# EAGLE schematic Dachmodul (EAGLE 8.2.0)
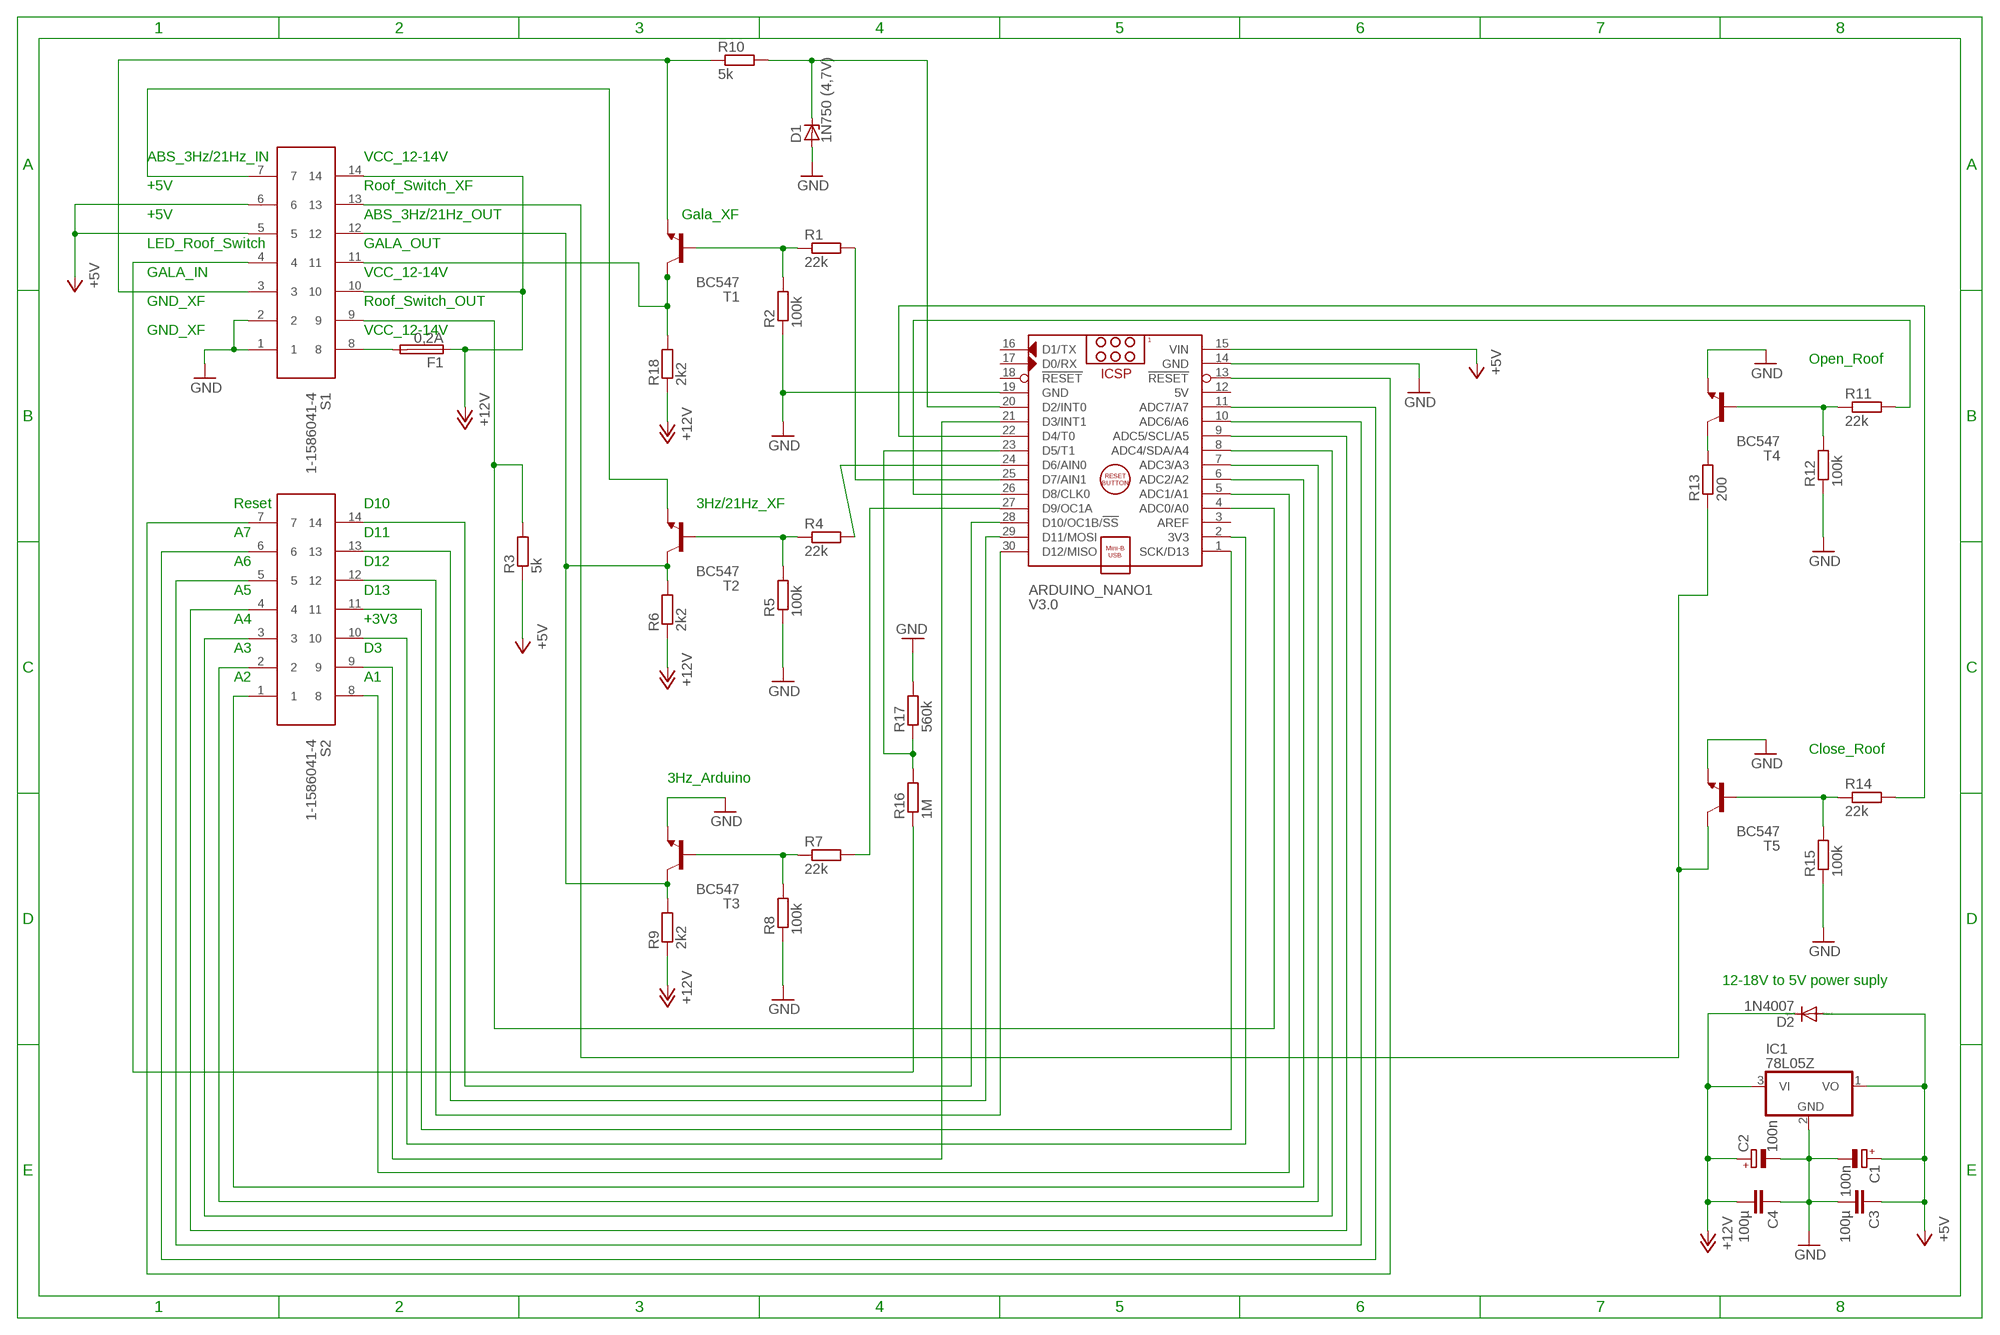
[diagram p0: schematic, sheet 1]

## Parts
ARDUINO_NANO1  V3.0  ARDUINO_NANO  [ARDUINO_NANO]
C1  100n  CPOL-EUE3.5-8  [E3,5-8]
C2  100n  CPOL-EUE3.5-8  [E3,5-8]
C3  100µ  C-EU025-025X050  [C025-025X050]
C4  100µ  C-EU025-025X050  [C025-025X050]
D1  1N750 (4,7V)  ZENER-DIODEZD-2.5  [ZDIO-2.5]
D2  1N4007  1N4004  [DO41-10]
F1  0,2A  GSH15  [GSH15]
IC1  78L05Z  [TO92]
R1  22k  R-EU_0204/5  [0204/5]
R2  100k  R-EU_0204/5  [0204/5]
R3  5k  R-EU_0204/5  [0204/5]
R4  22k  R-EU_0204/5  [0204/5]
R5  100k  R-EU_0204/5  [0204/5]
R6  2k2  R-EU_0204/5  [0204/5]
R7  22k  R-EU_0204/5  [0204/5]
R8  100k  R-EU_0204/5  [0204/5]
R9  2k2  R-EU_0204/5  [0204/5]
R10  5k  R-EU_0204/5  [0204/5]
R11  22k  R-EU_0204/5  [0204/5]
R12  100k  R-EU_0204/5  [0204/5]
R13  200  R-EU_0204/5  [0204/5]
R14  22k  R-EU_0204/5  [0204/5]
R15  100k  R-EU_0204/5  [0204/5]
R16  1M  R-EU_0204/5  [0204/5]
R17  560k  R-EU_0204/5  [0204/5]
R18  2k2  R-EU_0204/2V  [0204V]
S1  1-1586041-4  64901421022  [64901421022]
S2  1-1586041-4  64901421022  [64901421022]
T1  BC547  [TO92]
T2  BC547  [TO92]
T3  BC547  [TO92]
T4  BC547  [TO92]
T5  BC547  [TO92]

## Nets
+5V: ARDUINO_NANO1.15(VIN) C1.+ C3.1 D2.A IC1.1(VO) R3.1 S1.5 S1.6
+12V: C2.+ C4.2 D2.C F1.1 IC1.3(VI) R6.1 R9.1 R18.1 S1.10 S1.14
GND: ARDUINO_NANO1.14(GND) ARDUINO_NANO1.19(GND) C1.- C2.- C3.2 C4.1 D1.A IC1.2(GND) R2.1 R5.1 R8.1 R12.1 R15.1 R17.2 S1.1 S1.2 T3.1(E) T4.1(E) T5.1(E)
N$1: R1.1 R2.2 T1.2(B)
N$2: R18.2 S1.11 T1.3(C)
N$3: R4.1 R5.2 T2.2(B)
N$4: R6.2 R9.2 S1.12 T2.3(C) T3.3(C)
N$5: R7.1 R8.2 T3.2(B)
N$6: ARDUINO_NANO1.27(D9/OC1A) R7.2
N$7: S1.7 T2.1(E)
N$8: ARDUINO_NANO1.24(D6/AIN0) R4.2
N$9: R10.1 S1.3 T1.1(E)
N$11: ARDUINO_NANO1.25(D7/AIN1) R1.2
N$12: F1.2 S1.8
N$13: R13.2 T4.3(C)
N$14: R11.1 R12.2 T4.2(B)
N$15: ARDUINO_NANO1.26(D8/CLK0) R11.2
N$16: R13.1 S1.13 T5.3(C)
N$17: R14.1 R15.2 T5.2(B)
N$18: ARDUINO_NANO1.22(D4/T0) R14.2
N$19: ARDUINO_NANO1.28(D10/OC1B/!SS) S2.14
N$20: R16.1 S1.4
N$21: ARDUINO_NANO1.23(D5/T1) R16.2 R17.1
N$22: ARDUINO_NANO1.29(D11/MOSI) S2.13
N$23: ARDUINO_NANO1.30(D12/MISO) S2.12
N$24: ARDUINO_NANO1.1(SCK/D13) S2.11
N$25: ARDUINO_NANO1.2(3V3) S2.10
N$26: ARDUINO_NANO1.21(D3/INT1) S2.9
N$27: ARDUINO_NANO1.5(ADC1/A1) S2.8
N$28: ARDUINO_NANO1.6(ADC2/A2) S2.1
N$29: ARDUINO_NANO1.7(ADC3/A3) S2.2
N$30: ARDUINO_NANO1.8(ADC4/SDA/A4) S2.3
N$31: ARDUINO_NANO1.9(ADC5/SCL/A5) S2.4
N$32: ARDUINO_NANO1.10(ADC6/A6) S2.5
N$33: ARDUINO_NANO1.11(ADC7/A7) S2.6
N$34: ARDUINO_NANO1.13(!RESET) S2.7
N$35: ARDUINO_NANO1.4(ADC0/A0) R3.2 S1.9
N$36: ARDUINO_NANO1.20(D2/INT0) D1.C R10.2
Unconnected: ARDUINO_NANO1.3(AREF) ARDUINO_NANO1.16(D1/TX) ARDUINO_NANO1.17(D0/RX) ARDUINO_NANO1.18(!RESET)

## Notes on the sheet
- ABS_3Hz/21Hz_IN | VCC_12-14V
- +5V | Roof_Switch_XF
- +5V | ABS_3Hz/21Hz_OUT | Gala_XF
- LED_Roof_Switch | GALA_OUT
- GALA_IN | VCC_12-14V
- GND_XF | Roof_Switch_OUT
- GND_XF | VCC_12-14V
- Open_Roof
- Reset | D10 | 3Hz/21Hz_XF
- A7 | D11
- A6 | D12
- A5 | D13
- A4 | +3V3
- A3 | D3
- A2 | A1
- Close_Roof
- 3Hz_Arduino
- 12-18V to 5V power suply

## Power pins joined to a net without a drawn wire
5V: ARDUINO_NANO1.12(5V)

## Library data of the parts
ARDUINO_NANO1 = ArduinoNanoV30:ARDUINO_NANO: Arduino Nano V3.0 Module Overview: The Arduino Nano is a small, complete, and breadboard-friendly board based on the ATmega328 (Arduino Nano 3.x) or ATmega168 (Arduino Nano 2.x). It has more or less the same functionality of the Arduino Duemilanove, but in a different package. It lacks only a DC power jack, and works with a Mini-B USB cable instead of a standard one. The Nano was designed and is being produced by Gravitech <http://www.gravitech.us/arna30wiatp.html>. General specifications: Item Value Microcontroller Atmel ATmega168 or ATmega328 Operating Voltage (logic level) 5 V Input Voltage (recommended) 7-12 V Input Voltage (limits) 6-20 V Digital I/O Pins 14 (of which 6 provide PWM output) Analog Input Pins 8 DC Current per I/O Pin 40 mA Flash Memory 16 KB (ATmega168) or 32 KB (ATmega328) of which 2 KB used by bootloader SRAM 1 KB (ATmega168) or 2 KB (ATmega328) EEPROM 512 bytes (ATmega168) or 1 KB (ATmega328) Clock Speed 16 MHz Dimensions (Inches) 0.73" x 1.70" Dimensions (mm) 18mm x 45mm Overall height About 9 mm (not including pins) Weigth 5 g Power: The Arduino Nano can be powered via the Mini-B USB connection, 6-20V unregulated external power supply (pin 30), or 5V regulated external power supply (pin 27). The power source is automatically selected to the highest voltage source. Memory: The ATmega168 has 16 KB of flash memory for storing code (of which 2 KB is used for the bootloader); the ATmega328 has 32 KB, (also with 2 KB used for the bootloader). The ATmega168 has 1 KB of SRAM and 512 bytes of EEPROM (which can be read and written with the EEPROM library); the ATmega328 has 2 KB of SRAM and 1 KB of EEPROM. Input and Output: Each of the 14 digital pins on the Nano can be used as an input or output, using pinMode(), digitalWrite(), and digitalRead() functions. They operate at 5 volts. Each pin can provide or receive a maximum of 40 mA and has an internal pull-up resistor (disconnected by default) of 20-50 kOhms. In addition, some pins have specialized functions. Visit Arduino - ArduinoBoardNano <https://www.arduino.cc/en/Main/ArduinoBoardNano>
C1 C2 = rcl:CPOL-EU: POLARIZED CAPACITOR, European symbol
C3 C4 = rcl:C-EU: CAPACITOR, European symbol
D1 = diode:ZENER-DIODE: Z-Diode
D2 = diode:1N4004: DIODE general purpose rectifier, 1 A
F1 = fuse:GSH15: FUSE HOLDER grid 15mm, 19649 Wickmann; MPN: 64900001039; OC_FARNELL: 1271673; OC_NEWARK: 02P0318
IC1 = linear:78*: Positive VOLTAGE REGULATOR Source: http://cache.national.com/ds/LM/LM78L05.pdf http://www.fairchildsemi.com/ds/LM/LM7805.pdf
R1-R18 = rcl:R-EU_: RESISTOR, European symbol
S1 S2 = Wuerth_Elektronik_eiCan_Mini_Power_Connectors:64901421022: WR-MPC4-4.20mm Male Dual Row Angled Header with Mounting Flanges for Screw-in Retention,14 pins
T1-T5 = transistor:BC547: NPN TRANSISTOR